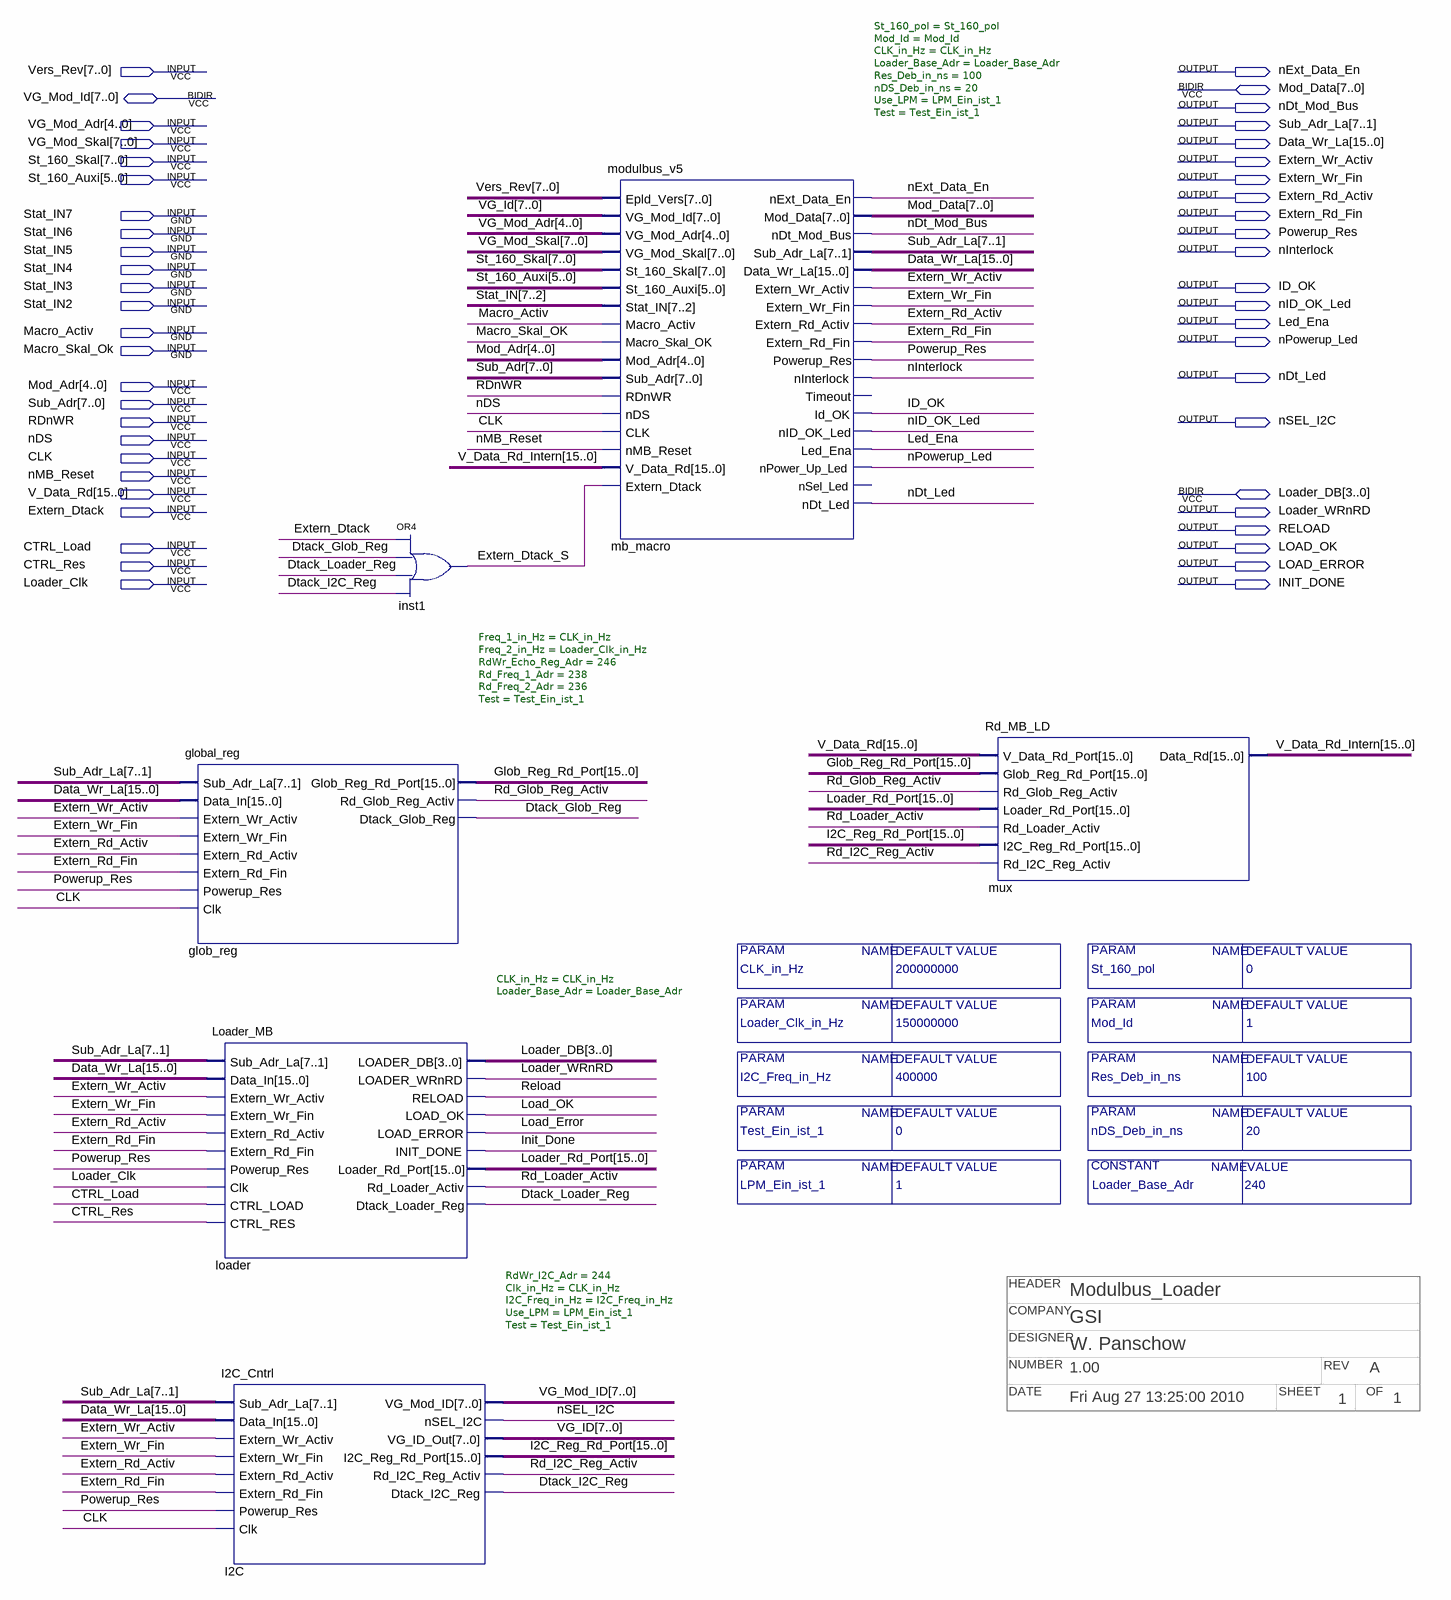
[diagram p0: schematic sheet]
// Quartus schematic Modulbus_Loader.bdf as structural Verilog: 6 symbols, 48 pins
// Title block: HEADER: Modulbus_Loader; COMPANY: GSI; DESIGNER: W. Panschow; NUMBER: 1.00; REV: A; DATE: Fri Aug 27 13:25:00 2010; SHEET: 1; OF: 1
module Modulbus_Loader #(parameter Loader_Clk_in_Hz = 150000000, parameter I2C_Freq_in_Hz = 400000, parameter St_160_pol = 0, parameter Res_Deb_in_ns = 100, parameter nDS_Deb_in_ns = 20, parameter Test_Ein_ist_1 = 0, parameter Loader_Base_Adr = 240, parameter LPM_Ein_ist_1 = 1, parameter Mod_Id = 1, parameter CLK_in_Hz = 200000000) (
  input  [7:0] Vers_Rev,
  input  [4:0] VG_Mod_Adr,
  input  [7:0] VG_Mod_Skal,
  input  [7:0] St_160_Skal,
  input  [5:0] St_160_Auxi,
  input  Stat_IN7,
  input  Stat_IN6,
  input  Stat_IN5,
  input  Stat_IN4,
  input  Stat_IN3,
  input  Stat_IN2,
  input  Macro_Activ,
  input  Macro_Skal_Ok,
  input  [4:0] Mod_Adr,
  input  [7:0] Sub_Adr,
  input  RDnWR,
  input  nDS,
  input  CLK,
  input  nMB_Reset,
  input  [15:0] V_Data_Rd,
  input  Extern_Dtack,
  input  CTRL_Load,
  input  CTRL_Res,
  input  Loader_Clk,
  inout  [7:0] Mod_Data,
  inout  [7:0] VG_Mod_Id,
  inout  [3:0] Loader_DB,
  output nExt_Data_En,
  output nDt_Mod_Bus,
  output [7:1] Sub_Adr_La,
  output [15:0] Data_Wr_La,
  output Extern_Wr_Activ,
  output Extern_Wr_Fin,
  output Extern_Rd_Activ,
  output Extern_Rd_Fin,
  output Powerup_Res,
  output nInterlock,
  output ID_OK,
  output nID_OK_Led,
  output Led_Ena,
  output nPowerup_Led,
  output nDt_Led,
  output nSEL_I2C,
  output Loader_WRnRD,
  output RELOAD,
  output LOAD_OK,
  output LOAD_ERROR,
  output INIT_DONE
);

  wire Dtack_Glob_Reg, Dtack_I2C_Reg, Dtack_Loader_Reg, Extern_Dtack_S, Rd_Glob_Reg_Activ, Rd_I2C_Reg_Activ,
       Rd_Loader_Activ;
  wire [7:0] VG_Id;
  wire [15:0] Glob_Reg_Rd_Port, I2C_Reg_Rd_Port, Loader_Rd_Port, V_Data_Rd_Intern;

  global_reg #(.Freq_1_in_Hz(CLK_in_Hz), .Freq_2_in_Hz(Loader_Clk_in_Hz), .RdWr_Echo_Reg_Adr(246), .Rd_Freq_1_Adr(238), .Rd_Freq_2_Adr(236), .Test(Test_Ein_ist_1)) glob_reg (
    .Sub_Adr_La(Sub_Adr_La), .Data_In(Data_Wr_La), .Extern_Wr_Activ(Extern_Wr_Activ),
    .Extern_Wr_Fin(Extern_Wr_Fin), .Extern_Rd_Activ(Extern_Rd_Activ), .Extern_Rd_Fin(Extern_Rd_Fin),
    .Powerup_Res(Powerup_Res), .Clk(CLK), .Glob_Reg_Rd_Port(Glob_Reg_Rd_Port),
    .Rd_Glob_Reg_Activ(Rd_Glob_Reg_Activ), .Dtack_Glob_Reg(Dtack_Glob_Reg));
  Loader_MB #(.CLK_in_Hz(CLK_in_Hz), .Loader_Base_Adr(Loader_Base_Adr)) loader (
    .Sub_Adr_La(Sub_Adr_La), .Data_In(Data_Wr_La), .Extern_Wr_Activ(Extern_Wr_Activ),
    .Extern_Wr_Fin(Extern_Wr_Fin), .Extern_Rd_Activ(Extern_Rd_Activ), .Extern_Rd_Fin(Extern_Rd_Fin),
    .Powerup_Res(Powerup_Res), .Clk(Loader_Clk), .CTRL_LOAD(CTRL_Load), .CTRL_RES(CTRL_Res),
    .LOADER_WRnRD(Loader_WRnRD), .RELOAD(RELOAD), .LOAD_OK(LOAD_OK), .LOAD_ERROR(LOAD_ERROR),
    .INIT_DONE(INIT_DONE), .Loader_Rd_Port(Loader_Rd_Port), .Rd_Loader_Activ(Rd_Loader_Activ),
    .Dtack_Loader_Reg(Dtack_Loader_Reg), .LOADER_DB(Loader_DB));
  I2C_Cntrl #(.RdWr_I2C_Adr(244), .Clk_in_Hz(CLK_in_Hz), .I2C_Freq_in_Hz(I2C_Freq_in_Hz), .Use_LPM(LPM_Ein_ist_1), .Test(Test_Ein_ist_1)) I2C (
    .Sub_Adr_La(Sub_Adr_La), .Data_In(Data_Wr_La), .Extern_Wr_Activ(Extern_Wr_Activ),
    .Extern_Wr_Fin(Extern_Wr_Fin), .Extern_Rd_Activ(Extern_Rd_Activ), .Extern_Rd_Fin(Extern_Rd_Fin),
    .Powerup_Res(Powerup_Res), .Clk(CLK), .nSEL_I2C(nSEL_I2C), .VG_ID_Out(VG_Id),
    .I2C_Reg_Rd_Port(I2C_Reg_Rd_Port), .Rd_I2C_Reg_Activ(Rd_I2C_Reg_Activ), .Dtack_I2C_Reg(Dtack_I2C_Reg),
    .VG_Mod_ID(VG_Mod_Id));
  or inst1 (Extern_Dtack_S, Extern_Dtack, Dtack_Glob_Reg, Dtack_Loader_Reg, Dtack_I2C_Reg);
  modulbus_v5 #(.St_160_pol(St_160_pol), .Mod_Id(Mod_Id), .CLK_in_Hz(CLK_in_Hz), .Loader_Base_Adr(Loader_Base_Adr), .Res_Deb_in_ns(100), .nDS_Deb_in_ns(20), .Use_LPM(LPM_Ein_ist_1), .Test(Test_Ein_ist_1)) mb_macro (
    .Epld_Vers(Vers_Rev), .VG_Mod_Id(VG_Id), .VG_Mod_Adr(VG_Mod_Adr), .VG_Mod_Skal(VG_Mod_Skal),
    .St_160_Skal(St_160_Skal), .St_160_Auxi(St_160_Auxi),
    .Stat_IN({Stat_IN7, Stat_IN6, Stat_IN5, Stat_IN4, Stat_IN3, Stat_IN2}), .Macro_Activ(Macro_Activ),
    .Macro_Skal_OK(Macro_Skal_Ok), .Mod_Adr(Mod_Adr), .Sub_Adr(Sub_Adr), .RDnWR(RDnWR), .nDS(nDS), .CLK(CLK),
    .nMB_Reset(nMB_Reset), .V_Data_Rd(V_Data_Rd_Intern), .Extern_Dtack(Extern_Dtack_S),
    .nExt_Data_En(nExt_Data_En), .nDt_Mod_Bus(nDt_Mod_Bus), .Sub_Adr_La(Sub_Adr_La), .Data_Wr_La(Data_Wr_La),
    .Extern_Wr_Activ(Extern_Wr_Activ), .Extern_Wr_Fin(Extern_Wr_Fin), .Extern_Rd_Activ(Extern_Rd_Activ),
    .Extern_Rd_Fin(Extern_Rd_Fin), .Powerup_Res(Powerup_Res), .nInterlock(nInterlock), .Id_OK(ID_OK),
    .nID_OK_Led(nID_OK_Led), .Led_Ena(Led_Ena), .nPower_Up_Led(nPowerup_Led), .nDt_Led(nDt_Led),
    .Mod_Data(Mod_Data));  // open: Timeout, nSel_Led
  Rd_MB_LD mux (
    .V_Data_Rd_Port(V_Data_Rd), .Glob_Reg_Rd_Port(Glob_Reg_Rd_Port), .Rd_Glob_Reg_Activ(Rd_Glob_Reg_Activ),
    .Loader_Rd_Port(Loader_Rd_Port), .Rd_Loader_Activ(Rd_Loader_Activ), .I2C_Reg_Rd_Port(I2C_Reg_Rd_Port),
    .Rd_I2C_Reg_Activ(Rd_I2C_Reg_Activ), .Data_Rd(V_Data_Rd_Intern));
endmodule
